# Altium project Gyroscope Breakout.PrjPcb
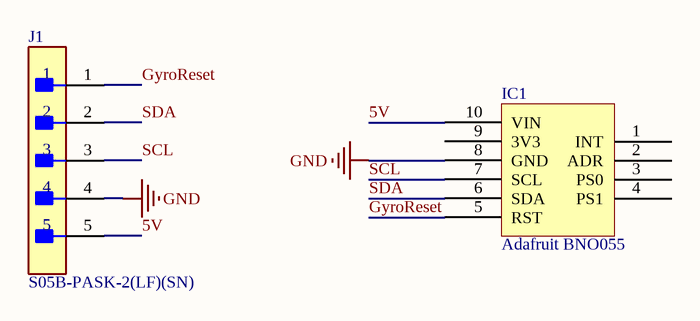
[diagram p0: GyroscopeBreakout.SchDoc]
1 sheet, 2 parts. Net scope: global (net labels, ports and power ports of the same name join across sheets).
Board file: GyroscopeBreakout.PcbDoc

## Sheet GyroscopeBreakout.SchDoc: Gyroscope Breakout
size A4; Engineer: Jouveer Naidoo; DocumentNumber: 5; Revision: 1; SheetNumber: 1; SheetTotal: 1; ProjectIdentifier: Spin Up

### Parts
IC1  Adafruit BNO055  [Adafruit BNO055-Footprint-1]
J1  S05B-PASK-2(LF)(SN)  [FP-S05B-PASK-2_LF_SN-MFG]

### Nets
GND: IC1.8(GND) J1.4
5V: IC1.10(VIN) J1.5
GyroReset: IC1.5(RST) J1.1
SCL: IC1.7(SCL) J1.3
SDA: IC1.6(SDA) J1.2

Not connected (* = marked no-connect by the designer): IC1 1(INT) 2(ADR) 3(PS0) 4(PS1) 9(3V3)

### Notes on the sheet
- Size:
- Date:
- Title
- A4
- Project:
- Time:
- Revision:
- Sheet
- of
- Engineer
- File:

### Library data of the parts
IC1 = CMP-001-0001-3
J1 = CMP-17439-000393-1: CONN HEADER R/A 5POS 2MM; Current Rating: 3A; Voltage Rating: 250V; Number of Contacts: 5; System: Connector; Contact Shape: Square; Orientation: Right Angle; Mount: Through Hole; Fastening Type: Ramp; Contact Material: Copper Alloy; Insulation Material: PBT; Insulation Color: Natural; Contact Type: Male Pin; Flammability Rating: UL94 V-0; Contact Plating: Tin; Connector Type: Header; Number of Positions: 5; Contact Finish - Mating: TIN; Housing Color: White; Color: Natural; Termination: Solder; Series: PA; Lead Free: Lead Free; Pitch: 2mm; Number of Rows: 1; Package Quantity: 500; Packaging: Bulk